# EAGLE design tRexRunnerNano (EAGLE 9.0.0)
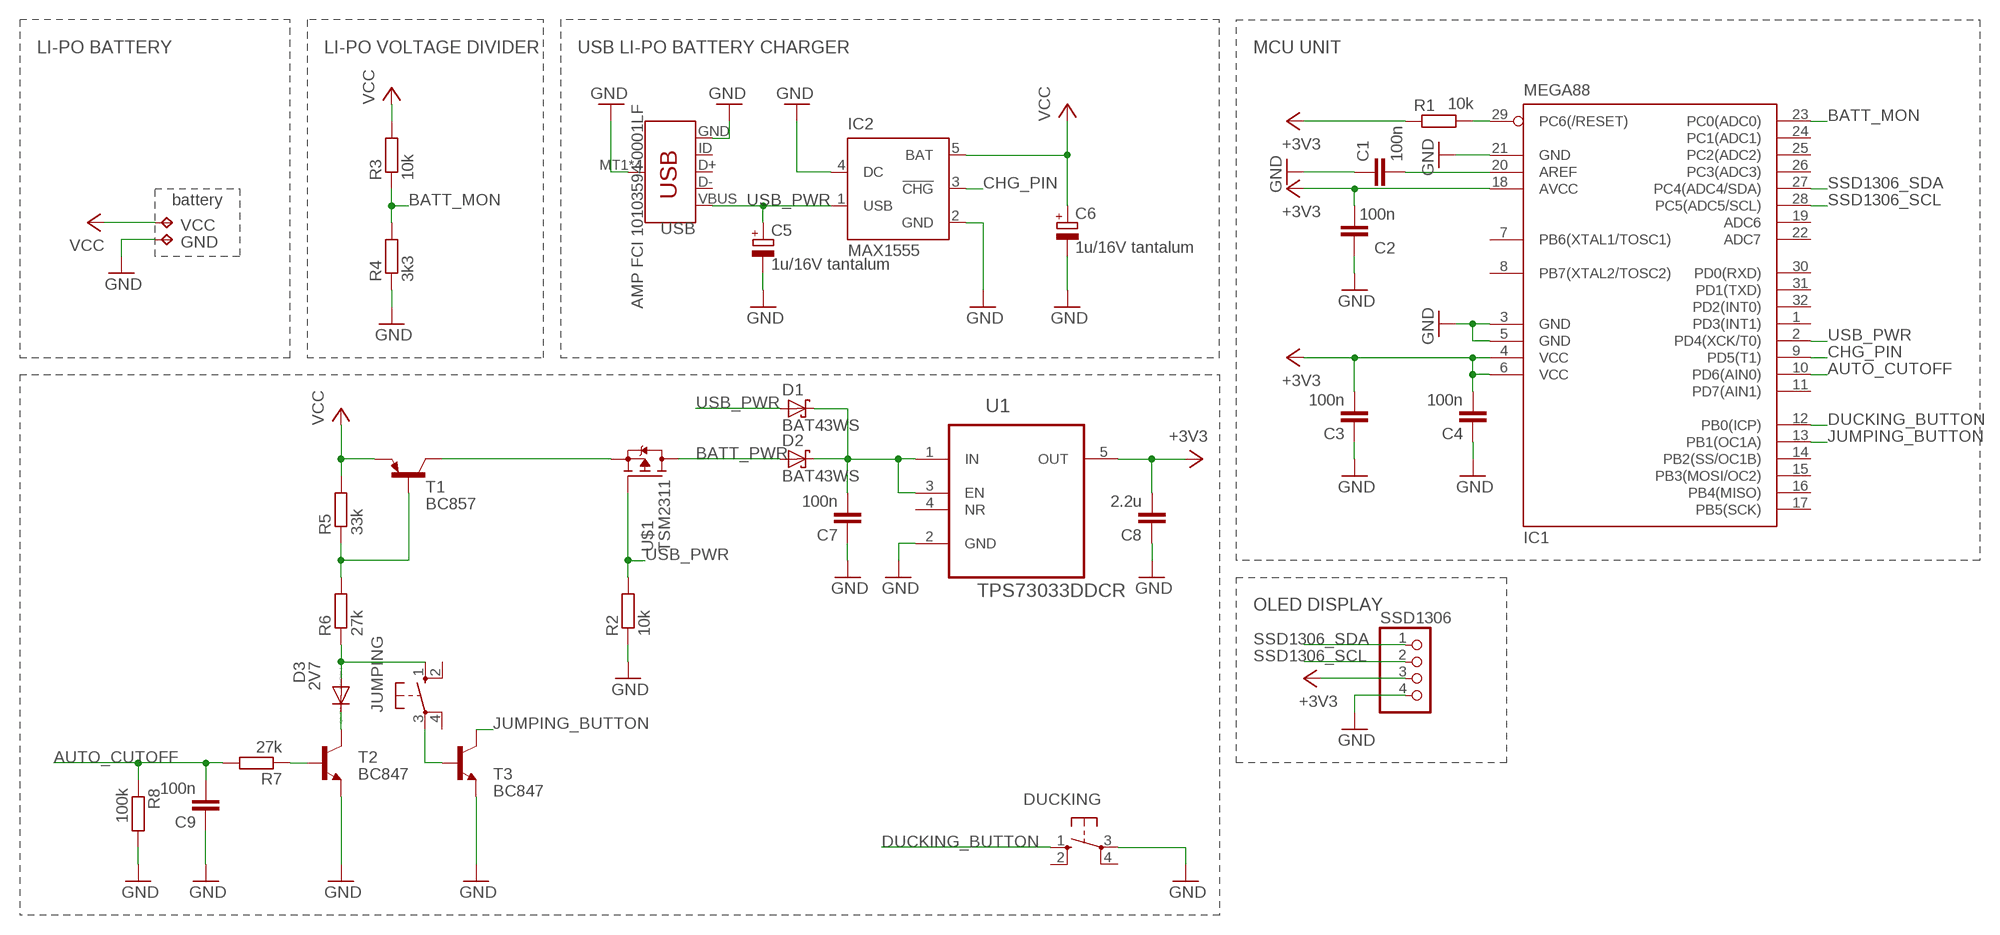
[diagram p0: schematic, sheet 1]

## Parts
C1  100n  C-EUC0805  [C0805]
C2  100n  C-EUC0805  [C0805]
C3  100n  C-EUC0805  [C0805]
C4  100n  C-EUC0805  [C0805]
C5  1u/16V tantalum  CPOL-EUSMCA  [SMC_A]
C6  1u/16V tantalum  CPOL-EUSMCA  [SMC_A]
C7  100n  C-EUC0805  [C0805]
C8  2.2u  C-EUC0805  [C0805]
C9  100n  C-EUC0805  [C0805]
D1  BAT43WS  BAT60J  [SOD323_ST]
D2  BAT43WS  BAT60J  [SOD323_ST]
D3  2V7  DIODE-SOD80C  [SOD80C]
DUCKING  10-XX  [B3F-10XX]
GND  TPTP12R  [TP12R]
IC1  MEGA88  MEGA8-AI  [TQFP32-08]
IC2  MAX1555  [SOT23-5L]
JUMPING  10-XX  [B3F-10XX]
R1  10k  R-EU_R0805  [R0805]
R2  10k  R-EU_R0805  [R0805]
R3  10k  R-EU_R0805  [R0805]
R4  3k3  R-EU_R0805  [R0805]
R5  33k  R-EU_R0805  [R0805]
R6  27k  R-EU_R0805  [R0805]
R7  27k  R-EU_R0805  [R0805]
R8  100k  R-EU_R0805  [R0805]
SSD1306  PINHD-1X4  [1X04]
T1  BC857  BC857A-PNP-SOT23-BEC  [SOT23-BEC]
T2  BC847  [SOT23]
T3  BC847  [SOT23]
U1  TPS73033DDCR  TPS73033DBVT  [SOT95P290X145-5N]
U$1  TSM2311  [SOT23]
USB  AMP FCI 10103594-0001LF  USB_MICRO-B_SMT  [USB-MICROB]
VCC  TPTP12R  [TP12R]

## Nets
+3V3: C2.2 C3.2 C4.2 C8.2 IC1.4(VCC) IC1.6(VCC) IC1.18(AVCC) R1.1 SSD1306.3 U1.5(OUT)
AUTO_CUTOFF: C9.2 IC1.10(PD6(AIN0)) R7.2 R8.1
BATT_MON: IC1.23(PC0(ADC0)) R3.1 R4.2
BATT_PWR: D2.A U$1.3(D)
CHG_PIN: IC1.9(PD5(T1)) IC2.3(!CHG)
DUCKING_BUTTON: DUCKING.1(S) IC1.12(PB0(ICP))
GND: C1.1 C2.1 C3.1 C4.1 C5.- C6.- C7.1 C8.1 C9.1 DUCKING.3(P) GND.TP IC1.3(GND) IC1.5(GND) IC1.21(GND) IC2.2(GND) IC2.4(DC) R2.1 R4.1 R8.2 SSD1306.4 T2.2(E) T3.2(E) U1.2(GND) USB.GND USB.MT1(SHIELD) USB.MT2(SHIELD) USB.P$1(SHIELD) USB.P$2(SHIELD)
JUMPING_BUTTON: IC1.13(PB1(OC1A)) T3.3(C)
N$1: IC1.29(PC6(/RESET)) R1.2
N$2: C1.2 IC1.20(AREF)
N$3: T1.C U$1.2(S)
N$4: C7.2 D1.C D2.C U1.1(IN) U1.3(EN)
N$5: R7.1 T2.1(B)
N$6: R5.1 R6.2 T1.B
N$7: D3.A JUMPING.1(S) R6.1
N$8: D3.C T2.3(C)
N$9: JUMPING.3(P) T3.1(B)
SSD1306_SCL: IC1.28(PC5(ADC5/SCL)) SSD1306.2
SSD1306_SDA: IC1.27(PC4(ADC4/SDA)) SSD1306.1
USB_PWR: C5.+ D1.A IC1.2(PD4(XCK/T0)) IC2.1(USB) R2.2 U$1.1(G) USB.VBUS
VCC: C6.+ IC2.5(BAT) R3.2 R5.2 T1.E VCC.TP
Unconnected: DUCKING.2(S1) DUCKING.4(P1) IC1.1(PD3(INT1)) IC1.7(PB6(XTAL1/TOSC1)) IC1.8(PB7(XTAL2/TOSC2)) IC1.11(PD7(AIN1)) IC1.14(PB2(SS/OC1B)) IC1.15(PB3(MOSI/OC2)) IC1.16(PB4(MISO)) IC1.17(PB5(SCK)) IC1.19(ADC6) IC1.22(ADC7) IC1.24(PC1(ADC1)) IC1.25(PC2(ADC2)) IC1.26(PC3(ADC3)) IC1.30(PD0(RXD)) IC1.31(PD1(TXD)) IC1.32(PD2(INT0)) JUMPING.2(S1) JUMPING.4(P1) U1.4(NR) USB.D+ USB.D- USB.ID

## Notes on the sheet
- LI-PO BATTERY | LI-PO VOLTAGE DIVIDER | USB LI-PO BATTERY CHARGER | MCU UNIT
- battery
- OLED DISPLAY

## Library data of the parts
C1-C4 C7-C9 = rcl:C-EU: CAPACITOR, European symbol; SPICEPREFIX: C
C5 C6 = rcl:CPOL-EU: POLARIZED CAPACITOR, European symbol; SPICEPREFIX: C
D1 D2 = diode:BAT60J: Schottky barrier diode Source: www.st.com, BAT60J.pdf
D3 = diode:DIODE-: DIODE
DUCKING JUMPING = switch-omron:10-XX: OMRON SWITCH; MPN: B3F-1000; OC_FARNELL: 176432; OC_NEWARK: 36M3542
GND VCC = testpad:TP: Test pad
IC1 = atmel:MEGA8: MICROCONTROLLER 8 Kbytes FLASH, 1 kbytes SRAM, 512 bytes EEPROM, USART, 6-channel 10 bit ADC, 2-channel 8 bit ADC Pin compatible with Atmega48, ATMega88, ATMega168 Source: avr.lbr; MPN: ATMEGA8-16AU; OC_FARNELL: 9171371; OC_NEWARK: 73M8863
IC2 = maxim:MAX1555: Dual-Input USB/AC Adapter 1-Cell Li+ Battery Chargers Source: http://www.maxim-ic.com .. MAX1551-MAX1555.pdf; MF: MAXIM; MPN: MAX1555EZK+T; OC_FARNELL: 1628222; OC_NEWARK: 59J2761
R1-R8 = rcl:R-EU_: RESISTOR, European symbol; SPICEPREFIX: R
SSD1306 = pinhead:PINHD-1X4: PIN HEADER
T1 = transistor:*-PNP-: PNP Transistror
T2 T3 = transistor:BC847: NPN TRANSISTOR
U1 = TPS799:TPS73033DBVT: V REG LDO 0.2A +3.3V, SOT-23-5; MPN: TPS73033DBVT; OC_FARNELL: 1135395; OC_NEWARK: 71J8233; PACKAGE: SOT-23-5; SUPPLIER: TEXAS INSTRUMENTS
U$1 = transistor-fet:TSM2311: 20V P-Channel MOSFET
USB = SparkFun-Connectors:USB_MICRO-B: USB Type Micro-B Connector Male/female and PTH/SMT variants SparkFun Products: SparkFun microB USB Breakout <https://www.sparkfun.com/products/12035> SparkFun USB microB Plug Breakout <https://www.sparkfun.com/products/10031> SparkFun ESP8266 Thing <https://www.sparkfun.com/products/13231>; PROD_ID: CONN-09505; SF_ID: PRT-08533

## Board
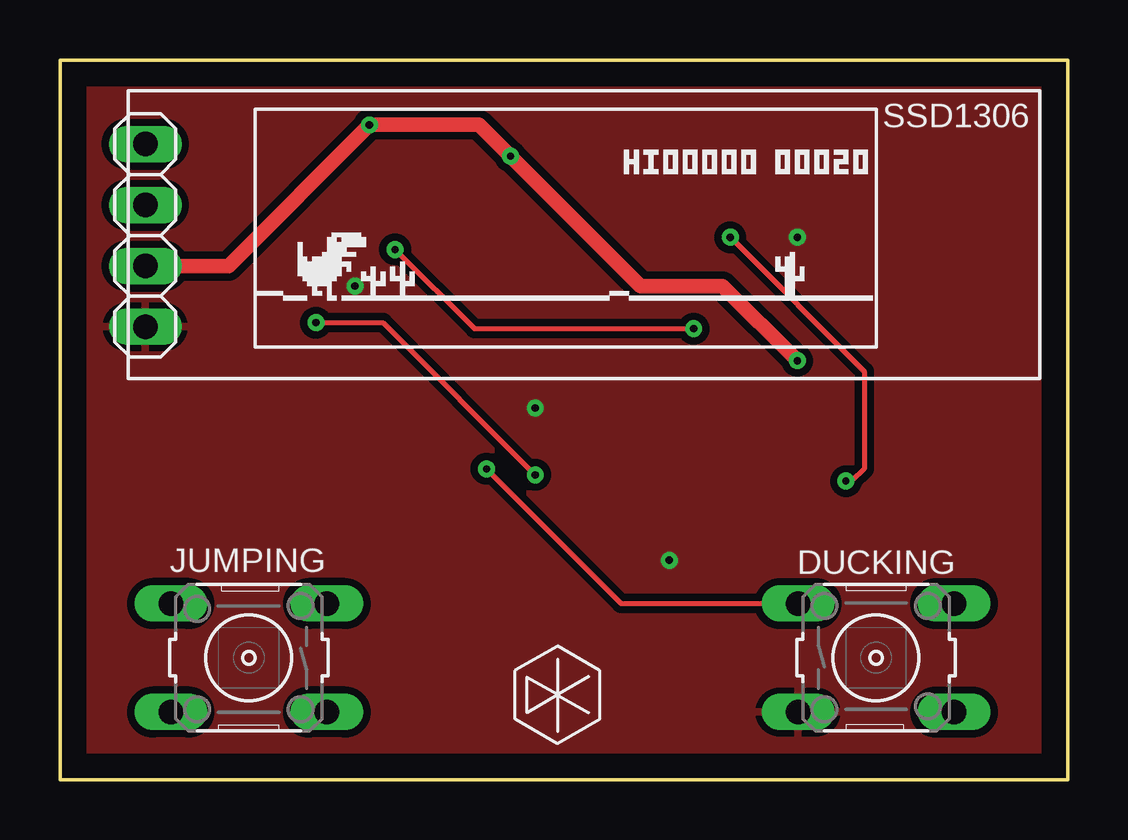
[diagram p1: board, top side]
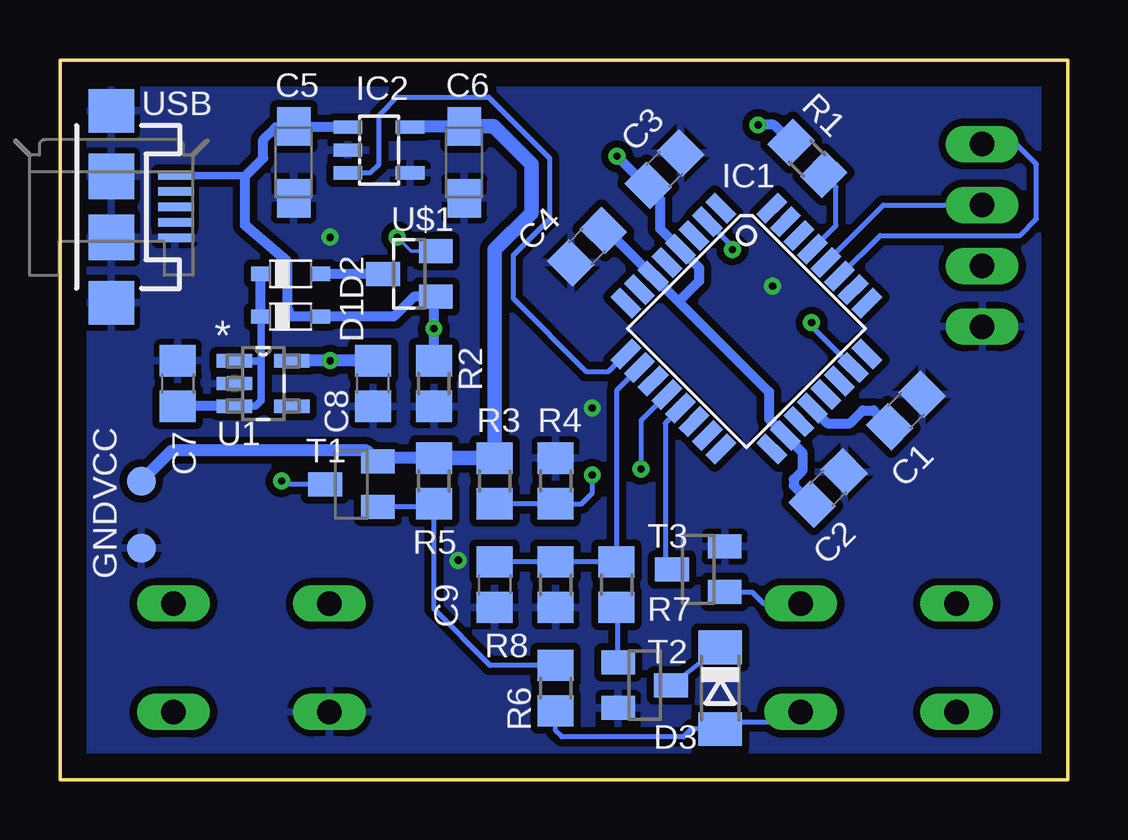
[diagram p2: board, bottom side, seen from below]

Size 42 x 30 mm. Coordinates in mm from the lower left corner, seen from the top.
Outline: 0,0 42,0 42,30 0,30 0,0
Copper layers (1*16): Top 0.035mm / dielectric 1.5mm / Bottom 0.035mm
Design rules "default *": minimum track width 6mil, minimum drill 10mil, track to track 6mil, track to pad 6mil, pad to pad 6mil, via to via 6mil, smd to smd 6mil, copper to edge 40mil, drill to drill 6mil, minimum pad ring 10mil, minimum via ring 8mil, stop-mask expansion 4mil, vias tented up to drill 0mil, thermal gap 10mil

### Footprints (pad centres in the part's own frame; a part is rotated, then mirrored left to right if it is on the bottom)
C0805 = smd 1.3 x 1.5: 1 -0.95,0; 2 0.95,0
SMC_A = smd 1.6 x 1.4: + -1.5,0; - 1.5,0
SOD323_ST = smd 0.8 x 0.6: A 1.25,0; C -1.25,0
SOD80C = smd 1.4 x 1.8: A 1.7,0; C -1.7,0
B3F-10XX = drill 1.016 long: 1 -3.251,2.261; 2 3.251,2.261; 3 -3.251,-2.261; 4 3.251,-2.261
TP12R = smd 1.2 x 1.2: TP 0,0
TQFP32-08 = smd 1.27 x 0.559: 1 -4.293,2.8; 2 -4.293,2; 3 -4.293,1.2; 4 -4.293,0.4; 5 -4.293,-0.4; 6 -4.293,-1.2; 7 -4.293,-2; 8 -4.293,-2.8; 17 4.293,-2.8; 18 4.293,-2; 19 4.293,-1.2; 20 4.293,-0.4; 21 4.293,0.4; 22 4.293,1.2; 23 4.293,2; 24 4.293,2.8 | smd 0.559 x 1.27: 9 -2.8,-4.293; 10 -2,-4.293; 11 -1.2,-4.293; 12 -0.4,-4.293; 13 0.4,-4.293; 14 1.2,-4.293; 15 2,-4.293; 16 2.8,-4.293; 25 2.8,4.293; 26 2,4.293; 27 1.2,4.293; 28 0.4,4.293; 29 -0.4,4.293; 30 -1.2,4.293; 31 -2,4.293; 32 -2.8,4.293
SOT23-5L = smd 0.55 x 1.2: 1 -0.95,-1.3; 2 0,-1.3; 3 0.95,-1.3; 4 0.95,1.3; 5 -0.95,1.3
R0805 = smd 1.3 x 1.5: 1 -0.95,0; 2 0.95,0
1X04 = drill 1.016 long: 1 -3.81,0; 2 -1.27,0; 3 1.27,0; 4 3.81,0
SOT23-BEC = smd 1 x 1.4: B -0.95,-1.1; C 0,1.1; E 0.95,-1.1
SOT23 = smd 1 x 1.4: 1 -0.95,-1.1; 2 0.95,-1.1; 3 0,1.1
SOT95P290X145-5N = smd 1.473 x 0.559: 1 -1.194,0.94; 2 -1.194,0; 3 -1.194,-0.94; 4 1.194,-0.94; 5 1.194,0.94
USB-MICROB = smd 1.4 x 0.35: D+ -2.65,0; D- -2.65,-0.65; GND -2.65,1.3; ID -2.65,0.65; VBUS -2.65,-1.3 | smd 1.9 x 1.8: MT1 0,-4; MT2 0,4 | smd 1.9 x 1.9: P$1 0,-1.27; P$2 0,1.27

### Placement (x,y rotation side)
C1  6.74,15.39 225 bottom
C2  9.98,12.16 225 bottom
C3  16.8,25.45 225 bottom
C4  20.03,22.21 45 bottom
C5  32.26,25.73 270 bottom
C6  25.15,25.73 270 bottom
C7  37.08,16.51 270 bottom
C8  28.96,16.51 90 bottom
C9  23.88,8.13 90 bottom
D1  32.38,19.3 0 bottom
D2  32.38,21.08 0 bottom
D3  14.48,3.81 270 bottom
DUCKING  34.02,5.08 0 top
GND  38.61,9.65 0 bottom
IC1  13.39,18.8 315 bottom
IC2  28.7,26.24 270 bottom
JUMPING  7.87,5.08 180 top
R1  10.85,25.9 315 bottom
R2  26.42,16.51 90 bottom
R3  23.88,12.45 90 bottom
R4  21.34,12.45 270 bottom
R5  26.42,12.45 90 bottom
R6  21.34,3.81 90 bottom
R7  18.8,8.13 90 bottom
R8  21.34,8.13 270 bottom
SSD1306  3.56,22.69 270 top
T1  29.85,12.31 90 bottom
T2  17.63,3.94 270 bottom
T3  15.39,8.76 90 bottom
U1  33.53,16.51 0 bottom
U$1  27.43,21.08 90 bottom
USB  39.86,23.88 180 bottom
VCC  38.61,12.45 0 bottom

### Tracks (layer width: path | path; a pad name or v marks a point on that pad's centre or on a via)
+3V3  (via drill 0.3)
  Top 0.61: v30.73,17.46 27.62,20.57 24.19,20.57 v18.78,25.99 17.47,27.29 v12.9,27.29 7.02,21.42 SSD1306.3
  Bottom 0.152: 16.12,20.02 16.21,19.93 | IC1.18 11.57,14.16 | 17.16,24.46 17.16,24.37 16.98,24.19 | IC1.6 17.37,20.99 | 19.17,22.89 C4.2 | C3.2 17.57,24.77
  Bottom 0.406: 16.12,20.02 15.36,20.78 15.36,21.34 IC1.4 16.98,22.96 16.98,24.19 | C2.2 11.41,12.25 11.41,12.52 11.05,12.88 11.05,13.64 11.57,14.16 12.45,15.03 12.45,16.16 16.21,19.93 IC1.6 19.17,22.89 | C3.2 17.16,24.46 | 17.57,24.77 v18.78,25.99 | R1.1 12.24,27.29 v12.9,27.29
  Bottom 0.508: C8.2 v30.73,17.46 U1.5
AUTO_CUTOFF
  Bottom 0.203: C9.2 R8.1 R7.2 18.8,16.22 IC1.10
BATT_MON  (via drill 0.3)
  Top 0.203: v10.67,19.05 13.46,19.05 v19.81,12.7
  Bottom 0.152: R4.2 20.76,11.5
  Bottom 0.203: R3.1 R4.2 20.25,11.5 19.81,11.94 v19.81,12.7 | IC1.23 10.67,18.91 v10.67,19.05
BATT_PWR
  Bottom 0.406: U$1.3 D2.A
CHG_PIN
  Bottom 0.203: IC2.3 29.06,25.29 28.7,25.65 28.7,27.69 27.94,28.45 24.13,28.45 21.59,25.91 21.59,23.37 23.11,21.84 23.11,20.07 20.07,17.02 19.13,17.02 IC1.9
DUCKING_BUTTON  (via drill 0.3)
  Top 0.203: v17.78,12.95 23.39,7.34 DUCKING.1
  Bottom 0.152: IC1.12
  Bottom 0.203: IC1.12 17.78,14.97 v17.78,12.95
GND  (via drill 0.3)
  other vias: 30.73,22.61 19.81,15.49 25.4,9.14 12.29,20.57
  pour Bottom (isolate 0.305): -0.24,30.5 42.33,30.5 42.33,-0.27 -0.24,-0.27
  pour Top (isolate 0.305): -0.25,30.73 42.67,30.73 42.67,-1.02 -0.25,-1.02
JUMPING_BUTTON
  Bottom 0.152: 16.76,9.04 T3.3
  Bottom 0.203: IC1.13 16.76,14.86 16.76,9.04
N$1
  Bottom 0.203: R1.2 9.65,24.7 9.65,23.1 IC1.29
N$2
  Bottom 0.406: IC1.20 10,14.85 9.08,14.85 8.54,15.39 8.09,15.39 C1.2
N$3  (via drill 0.3)
  Top 0.203: v27.94,22.61 33.53,17.02 33.53,12.95 33.02,12.45 v32.77,12.45
  Bottom 0.152: U$1.2 27.37,22.03 v27.94,22.61
  Bottom 0.203: T1.C 32.63,12.31 v32.77,12.45
N$4
  Bottom 0.152: U1.3 34.73,15.56
  Bottom 0.305: U1.3 33.84,15.57 33.61,15.8 33.61,17.45 | U1.1 33.61,17.45 | D1.C 33.61,19.28 33.61,17.45
  Bottom 0.406: D1.C D2.C | U1.3 C7.2
N$5
  Bottom 0.152: 18.73,7.11 R7.1
  Bottom 0.203: T2.1 18.73,7.11
N$6
  Bottom 0.152: R5.1 26.56,11.36
  Bottom 0.203: R6.2 24.06,4.76 26.42,7.11 R5.1 | 26.56,11.36 T1.B
N$7
  Bottom 0.152: 14.48,2.41 D3.A 14.65,2.29 | R6.1 21.34,3.3
  Bottom 0.203: 14.48,2.41 11.22,2.41 JUMPING.1 | D3.A 15.67,2.11 16,1.78 21.08,1.78 21.34,2.03 R6.1
N$8
  Bottom 0.203: 14.53,5.46 T2.3
  Bottom 0.254: D3.C 14.53,5.46
N$9
  Bottom 0.203: T3.1 13.15,7.81 12.68,7.34 JUMPING.3
SSD1306_SCL
  Bottom 0.203: IC1.28 7.67,23.96 SSD1306.2
SSD1306_SDA
  Bottom 0.203: IC1.27 7.81,22.69 1.98,22.69 1.29,23.37 1.29,25.65 2.14,26.5 SSD1306.1
USB_PWR  (via drill 0.3)
  Top 0.203: v13.97,22.1 17.27,18.8 v26.42,18.8
  Bottom 0.152: IC2.1 30.07,27.26 | 32.22,27.19 32,27.19 32.1,27.29 | 32.22,27.19 C5.+ 32.46,27.03 | 34.32,25.18 34.29,25.15 | 32.23,27.18 32.22,27.19
  Bottom 0.203: IC1.2 13.97,22.21 v13.97,22.1
  Bottom 0.305: USB.VBUS 34.32,25.18
  Bottom 0.406: IC2.1 32,27.19 | 32.23,27.18 33.02,27.18 33.53,26.67 33.53,25.91 34.29,25.15 34.29,23.11 32.51,21.59 32.51,19.68 32.38,19.3 D1.A 28.07,19.3 27.25,20.13 U$1.1 26.42,20.05 v26.42,18.8 R2.2
VCC
  Bottom 0.152: 25.19,27.19 C6.+ | IC2.5 27.36,27.23
  Bottom 0.508: 27.36,27.23 C6.+ | R5.2 28.61,13.4 T1.E 29.21,13.72 37.34,13.72 VCC.TP
  Bottom 0.61: C6.+ 23.93,27.23 22.35,25.65 22.35,23.62 23.88,22.1 R3.2 R5.2 26.46,13.44